# Altium project DCAC.PrjPcb (part 2 of 11)
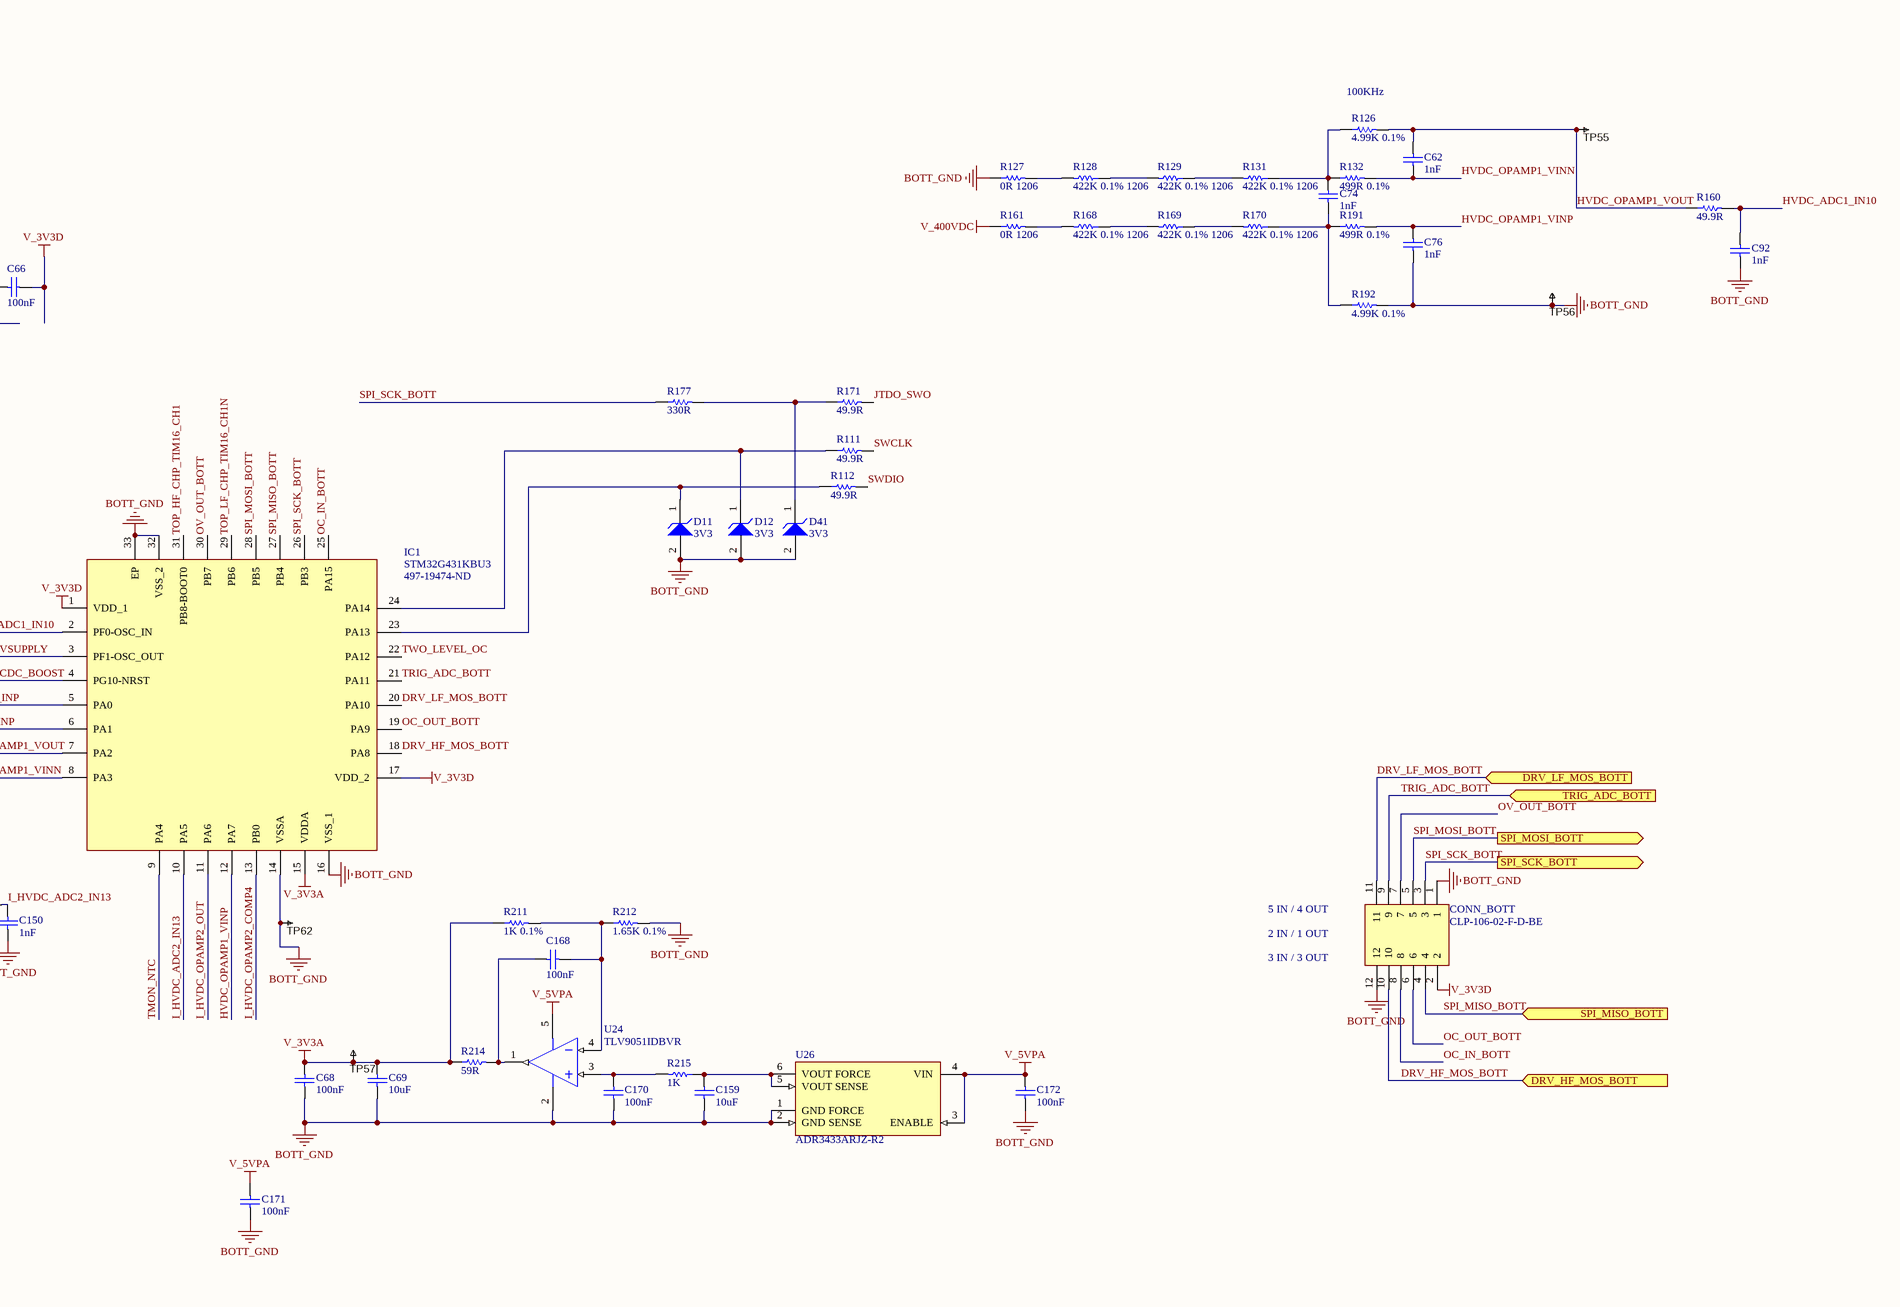
[diagram p12: Control_Sense_BOTT.SchDoc, bottom right]

## Sheet Control_Sense_BOTT.SchDoc (continued)
### Library data of the parts
BR1 = CD-HD2006L: Bridge Rectifier; Manufacturer_Name: Bourns; Datasheet Link: https://componentsearchengine.com/Datasheets/1/CD-HD2006L.pdf; Height: 1.22mm; Manufacturer_Part_Number: CD-HD2006L; Mouser Part Number: 652-CD-HD2006L; Mouser Price/Stock: https://www.mouser.co.uk/ProductDetail/Bourns/CD-HD2006L?qs=zwwtnr6GuIxiiAFbFRVfeg%3D%3D; Arrow Part Number: CD-HD2006L; Arrow Price/Stock: https://www.arrow.com/en/products/cd-hd2006l/bourns
C8 C186 = CAP: X5R ±10% 10V 22uF 1206 Multilayer Ceramic Capacitors MLCC - SMD/SMT ROHS; Manufacturer: Kyocera AVX; Manufacturer Part Number: 12066C226KAT2A; Tolerance: Â±10%; Case-EIA: 1206; Rated Voltage: 6.3 V; Case-Metric: 3216; Voltage Rating: 6.3V; Dielectric: X7R; Dissipation Factor: 5%; Technology: SMT; Max Thickness: 1.9 mm; Value: 22uF; Supplier 1: Digi-Key; Supplier Part Number 1: 478-5997-1-ND; RoHS: Yes; Category: Ceramic Capacitors; Stock 1: 4915; Pricing 1: 1=0.81000, 10=0.57100, 100=0.37570, 500=0.27830, 1000=0.23656 (USD); Mount: Surface Mount; Case/Package: 1206; Number of Pins: 2; Case Code (Imperial): 1206; Case Code (Metric): 3216; Contact Plating: Tin,Matte; Min Operating Temperature: -55°C; Max Operating Temperature: 125°C; Capacitance: 22uF; Packaging: Tape and Reel; Package Quantity: 2500; Termination: SMD/SMT; Voltage Rating (DC): 6.3V; Voltage: 6.3V; Length: 3.2mm; Height: 1.78mm; Width: 1.6mm; Depth: 1.6mm; Thickness: 0.07inch; Radiation Hardening: No; REACH SVHC: No SVHC; Lead Free: Lead Free; ComponentLink1URL: https://datasheet.ciiva.com/11786/0900766b80dc2409-11786266.pdf?src-supplier=RSComponents; ComponentLink1Description: https://datasheet.ciiva.com/11786/0900766b80dc2409-11786266.pdf?src-supplier=RSComponents; ComponentLink2URL: https://datasheet.ciiva.com/16315/cx7r-16315655.pdf?src-supplier=Future+Electronics; ComponentLink2Description: https://datasheet.ciiva.com/16315/cx7r-16315655.pdf?src-supplier=Future+Electronics; ComponentLink3URL: https://datasheet.ciiva.com/154/cx7r-154924.pdf?src-supplier=Digi-Key; ComponentLink3Description: https://datasheet.ciiva.com/154/cx7r-154924.pdf?src-supplier=Digi-Key; ComponentLink4URL: https://datasheet.ciiva.com/154/cx7r-154925.pdf?src-supplier=Digi-Key; ComponentLink4Description: https://datasheet.ciiva.com/154/cx7r-154925.pdf?src-supplier=Digi-Key; ComponentLink5URL: https://datasheet.ciiva.com/154/cx7r-154926.pdf?src-supplier=Digi-Key; ComponentLink5Description: https://datasheet.ciiva.com/154/cx7r-154926.pdf?src-supplier=Digi-Key; Parameter 1: *; JLCPCB Part #: C5672
C13 C177 = CAP-NP-2: X5R ±10% 50V 1uF 0603 Multilayer Ceramic Capacitors MLCC - SMD/SMT ROHS; Manufacturer: AVX; Rated Voltage: 10V; Capacitance: 1µF; Datasheet Version: 10/2007; Mounting Technology: SurfaceMount; Datasheet URL: https://datasheet.ciiva.com/11787/0900766b80a45521-11787469.pdf; Tolerance (%): ±10%; Package Description: 2-Pin Surface Mount Device, Body 1.6 x 0.81 mm; Case Size/Dimension: 0603; Package Reference: 0603; Manufacturer URL: http://www.avx.com/; Dielectric: X5R; Parameter 1: *; JLCPCB Part #: C15849
C23 C56 C57 C120 C121 C185 = CMP-2006-02595-1: C0G ±5% 50V 100pF 0603 Multilayer Ceramic Capacitors MLCC - SMD/SMT ROHS; Part Number: GRM1885C1H101JA01D; Manufacturer: Murata; Temperature Coefficient: 30ppm/°C; Insulation Resistance: 10GR; Supplier 1: Digi-Key; Supplier Part Number 1: 490-1427-1-ND; Manufacturer Part Number: GRM1885C1H101JA01D; RoHS: Yes; Category: Ceramic Capacitors; Pricing 1: 1=0.10000, 10=0.06100, 50=0.03320, 100=0.02700, 500=0.01932, 1000=0.01518 (USD); Mount: Surface Mount; Case/Package: 0603; Number of Pins: 2; Case Code (Metric): 1608; Case Code (Imperial): 0603; Dielectric Material: Ceramic; Material: Ceramic; Weight: 7.1E-05oz; Min Operating Temperature: -55°C; Max Operating Temperature: 125°C; Capacitance: 100pF; Voltage Rating: 50V; Tolerance: 5%; Packaging: Tape and Reel; Package Quantity: 1; Voltage Rating (DC): 50V; Dielectric: C0G; Termination: SMD/SMT; Voltage: 50V; Length: 1.6mm; Width: 0.031inch; Height: 0.8mm; Thickness: 0.035inch; Depth: 0.8mm; Radiation Hardening: No; REACH SVHC: Unknown; RoHS Compliant: Yes; Lead Free: Lead Free; ComponentLink1URL: https://datasheet.ciiva.com/131/product-131088.pdf?src-supplier=Digi-Key; ComponentLink1Description: https://datasheet.ciiva.com/131/product-131088.pdf?src-supplier=Digi-Key; ComponentLink2URL: https://datasheet.ciiva.com/18100/getdatasheetpartid-26823-18100641.pdf?src-supplier=Verical; ComponentLink2Description: https://datasheet.ciiva.com/18100/getdatasheetpartid-26823-18100641.pdf?src-supplier=Verical; ComponentLink3URL: https://datasheet.ciiva.com/3777/grm1885c1h101ja0123-3777264.pdf?src-supplier=Arrow+Electronics; ComponentLink3Description: https://datasheet.ciiva.com/3777/grm1885c1h101ja0123-3777264.pdf?src-supplier=Arrow+Electronics; ComponentLink4URL: https://datasheet.ciiva.com/29149/450134-da-01-en-vs-kondensator-0603-29149008.pdf?src-supplier=Conrad; ComponentLink4Description: https://datasheet.ciiva.com/29149/450134-da-01-en-vs-kondensator-0603-29149008.pdf?src-supplier=Conrad; ComponentLink5URL: https://datasheet.ciiva.com/131/partnumbering-e-01-131089.pdf?src-supplier=Digi-Key; ComponentLink5Description: https://datasheet.ciiva.com/131/partnumbering-e-01-131089.pdf?src-supplier=Digi-Key; ComponentLink6URL: https://datasheet.ciiva.com/11605/c02e-11605557.pdf?src-supplier=Avnet; ComponentLink6Description: https://datasheet.ciiva.com/11605/c02e-11605557.pdf?src-supplier=Avnet; ComponentLink7URL: https://datasheet.ciiva.com/28556/4360-28556551.pdf?src-supplier=Element14; ComponentLink7Description: https://datasheet.ciiva.com/28556/4360-28556551.pdf?src-supplier=Element14; ComponentLink8URL: https://datasheet.ciiva.com/7828/4360-7828889.pdf?src-supplier=Element14; ComponentLink8Description: https://datasheet.ciiva.com/7828/4360-7828889.pdf?src-supplier=Element14; ComponentLink9URL: https://datasheet.ciiva.com/7828/4360-7828890.pdf?src-supplier=Element14; ComponentLink9Description: https://datasheet.ciiva.com/7828/4360-7828890.pdf?src-supplier=Element14; ComponentLink10URL: https://datasheet.ciiva.com/7828/4360-7828891.pdf?src-supplier=Element14; ComponentLink10Description: https://datasheet.ciiva.com/7828/4360-7828891.pdf?src-supplier=Element14; ComponentLink11URL: https://datasheet.ciiva.com/14116/grmseries-tc-hitype-eng-14116828.pdf?src-supplier=Distrelec; ComponentLink11Description: https://datasheet.ciiva.com/14116/grmseries-tc-hitype-eng-14116828.pdf?src-supplier=Distrelec; ComponentLink12URL: https://datasheet.ciiva.com/16291/product-16291613.pdf?src-supplier=Future+Electronics; ComponentLink12Description: https://datasheet.ciiva.com/16291/product-16291613.pdf?src-supplier=Future+Electronics; ComponentLink13URL: https://datasheet.ciiva.com/131/partnumbering-e-01-131087.pdf?src-supplier=Digi-Key; ComponentLink13Description: https://datasheet.ciiva.com/131/partnumbering-e-01-131087.pdf?src-supplier=Digi-Key; ComponentLink14URL: https://datasheet.ciiva.com/14116/grmseries-tc-hitype-eng-14116815.pdf?src-supplier=Distrelec; ComponentLink14Description: https://datasheet.ciiva.com/14116/grmseries-tc-hitype-eng-14116815.pdf?src-supplier=Distrelec; JLCPCB Part #: C14858
  C23: Stock 1: 416176
  C56 C57 C120 C121 C185: Stock 1: 98306
C25-C28 C42 C43 C45 C47 C49 = CAP-NP-2: X5R ±10% 50V 10uF 1206 Multilayer Ceramic Capacitors MLCC - SMD/SMT ROHS; Manufacturer: AVX; Rated Voltage: 25V; Capacitance: 10µF; Mounting Technology: SurfaceMount; Package Reference: 1206; Tolerance (%): ±10%; Manufacturer URL: http://www.avx.com/; Datasheet URL: http://datasheets.avx.com/cx5r.pdf; Package Description: 2-Pin Surface Mount Device, Body 3.2 x 1.6 mm; Dielectric: X5R; Datasheet Version: 05/2016; Case Size/Dimension: 1206; JLCPCB Part #: C13585
C48 C53 C69 C90 C91 C100 C127 C173 = CAP: X5R 25V ±10% 10uF 0805 Multilayer Ceramic Capacitors MLCC - SMD/SMT ROHS; Part Number: GRM21BR71A106KE51L; Manufacturer: Murata; Parameter 1: *; JLCPCB Part #: C15850
C54 C55 C58 C66 C67 C71 C95 C98 C107 C109 C112 C123 C126 C136-C138 C161 C168 C170-C172 C176 C182 = CAP: X7R 100nF ±10% 50V 0603 Multilayer Ceramic Capacitors MLCC - SMD/SMT ROHS; Part Number: GCM188R72A104KA64D; Manufacturer: Murata; Manufacturer Part Number: CC0603KRX7R9BB104; Voltage Rating: 100V; Supplier 1: Arrow Electronics; Supplier Part Number 1: GCM188R72A104KA64D; RoHS: Yes; Category: Ceramic Capacitors; Mount: Surface Mount; Case/Package: 0603; Case Code (Imperial): 0603; Case Code (Metric): 1608; Min Operating Temperature: -55°C; Max Operating Temperature: 125°C; Tolerance: 10%; Packaging: Tape and Reel; Capacitance: 100nF; Dielectric: X7R; Termination: SMD/SMT; Voltage Rating (DC): 100V; Length: 1.6mm; Height: 0.8mm; Depth: 0.8mm; Radiation Hardening: No; ComponentLink1URL: https://datasheet.ciiva.com/17451/product-17451047.pdf?src-supplier=Avnet+Europe; ComponentLink1Description: https://datasheet.ciiva.com/17451/product-17451047.pdf?src-supplier=Avnet+Europe; ComponentLink2URL: https://datasheet.ciiva.com/26889/getdatasheetpartid-387765-26889164.pdf?src-supplier=Verical; ComponentLink2Description: https://datasheet.ciiva.com/26889/getdatasheetpartid-387765-26889164.pdf?src-supplier=Verical; Parameter 1: *; JLCPCB Part #: C14663
C62 C74 C76 = CMP-2006-04245-1: X7R 1nF ±10% 50V 0603 Multilayer Ceramic Capacitors MLCC - SMD/SMT ROHS; Manufacturer: AVX Interconnect / Elco; Part Number: 06035A151JAT2A.; Manufacturer Part Number: 06035A151JAT2A; Capacitance: 100pF; Tolerance: 5%; Dielectric: C0G; Temperature Coefficient: 30ppm/°C; Insulation Resistance: 100GR; Supplier 1: Digi-Key; Supplier Part Number 1: 478-1177-1-ND; RoHS: Yes; Category: Ceramic Capacitors; Stock 1: 63714; Pricing 1: 1=0.12000, 10=0.08900, 100=0.04180, 500=0.02932, 1000=0.02428 (USD); Mount: Surface Mount,PCB; Case/Package: 0603; Number of Pins: 2; Case Code (Metric): 1608; Case Code (Imperial): 0603; Dielectric Material: Ceramic; Contact Plating: Tin,Matte; Min Operating Temperature: -55°C; Max Operating Temperature: 125°C; Voltage Rating (DC): 50V; Voltage Rating: 50V; Packaging: Tape and Reel; Package Quantity: 1; Termination: SMD/SMT; Voltage: 50V; Length: 1.6mm; Height: 0.86mm; Width: 0.032inch; Depth: 0.81mm; Thickness: 0.035inch; Radiation Hardening: No; Lead Free: Lead Free; REACH SVHC: No SVHC; ComponentLink1URL: https://datasheet.ciiva.com/1124/84496-1124721.pdf?src-supplier=Element14; ComponentLink1Description: https://datasheet.ciiva.com/1124/84496-1124721.pdf?src-supplier=Element14; ComponentLink2URL: https://datasheet.ciiva.com/2987/ccog-2987781.pdf?src-supplier=Avnet; ComponentLink2Description: https://datasheet.ciiva.com/2987/ccog-2987781.pdf?src-supplier=Avnet; ComponentLink3URL: https://datasheet.ciiva.com/7855/759117-7855061.pdf?src-supplier=Element14; ComponentLink3Description: https://datasheet.ciiva.com/7855/759117-7855061.pdf?src-supplier=Element14; ComponentLink4URL: https://datasheet.ciiva.com/2987/ccog-2987782.pdf?src-supplier=Avnet; ComponentLink4Description: https://datasheet.ciiva.com/2987/ccog-2987782.pdf?src-supplier=Avnet; ComponentLink5URL: https://datasheet.ciiva.com/156/ccog-156216.pdf?src-supplier=Digi-Key; ComponentLink5Description: https://datasheet.ciiva.com/156/ccog-156216.pdf?src-supplier=Digi-Key; ComponentLink6URL: https://datasheet.ciiva.com/156/ccog-156217.pdf?src-supplier=Digi-Key; ComponentLink6Description: https://datasheet.ciiva.com/156/ccog-156217.pdf?src-supplier=Digi-Key; ComponentLink7URL: https://datasheet.ciiva.com/156/ccog-156218.pdf?src-supplier=Digi-Key; ComponentLink7Description: https://datasheet.ciiva.com/156/ccog-156218.pdf?src-supplier=Digi-Key; ComponentLink8URL: https://datasheet.ciiva.com/16300/ccog-16300429.pdf?src-supplier=Future+Electronics; ComponentLink8Description: https://datasheet.ciiva.com/16300/ccog-16300429.pdf?src-supplier=Future+Electronics; ComponentLink9URL: https://datasheet.ciiva.com/22699/84496-22699966.pdf?src-supplier=Element14; ComponentLink9Description: https://datasheet.ciiva.com/22699/84496-22699966.pdf?src-supplier=Element14; ComponentLink10URL: https://datasheet.ciiva.com/5418/ccog-5418335.pdf?src-supplier=Mouser; ComponentLink10Description: https://datasheet.ciiva.com/5418/ccog-5418335.pdf?src-supplier=Mouser; ComponentLink11URL: https://datasheet.ciiva.com/16538/ccog-16538111.pdf?src-supplier=Avnet+Asia; ComponentLink11Description: https://datasheet.ciiva.com/16538/ccog-16538111.pdf?src-supplier=Avnet+Asia; Parameter 2: *; JLCPCB Part #: C1588
C68 C72 C104 C114 = CAP: X7R 100nF ±10% 16V 0402 Multilayer Ceramic Capacitors MLCC - SMD/SMT ROHS; Manufacturer: AVX Interconnect / Elco; Part Number: 04026D104KAT2A; Voltage Rating: 6.3V; Dielectric: X5R; Supplier 1: Newark; Supplier Part Number 1: 34M9214; Manufacturer Part Number: 04026D104KAT2A; RoHS: Yes; Category: Ceramic Capacitors; Stock 1: 1436; Pricing 1: 10=0.02800, 25=0.02300, 50=0.01800, 100=0.01200, 250=0.01100, 500=0.00900, 1000=0.00700 (USD); Mount: Surface Mount; Case/Package: 0402; Case Code (Metric): 1005; Case Code (Imperial): 0402; Contact Plating: Tin,Matte; Dielectric Material: Ceramic; Min Operating Temperature: -55°C; Max Operating Temperature: 85°C; Package Quantity: 1; Packaging: Tape and Reel; Capacitance: 100nF; Tolerance: 10%; Voltage Rating (DC): 6.3V; Voltage: 6.3V; Termination: SMD/SMT; Series: -; Construction: Flat; Length: 1mm; Width: 0.02inch; Height: 0.56mm; Thickness: 0.022inch; Depth: 0.5mm; Radiation Hardening: No; REACH SVHC: No SVHC; Lead Free: Lead Free; RoHS Compliant: Yes; Parameter 1: *; JLCPCB Part #: C1525
C77 = CAP-NP-2: X7R ±10% 50V 4.7uF 1206 Multilayer Ceramic Capacitors MLCC - SMD/SMT ROHS; Manufacturer: Kemet; Temperature Coefficient / Code: +/-15%; Voltage Rating DC: 25V; Capacitance - nF: 1000nF; Class: Class1; Case Length: 3.2mm; Type: SMDMLCCX7R6.3-250VDCCommericalGrade; Case Width: 1.6mm; Product: GeneralTypeMLCCs; Dielectric: X7R; Datasheet URL: https://ciiva.com/datasheet-click-18194173?src=ciiva&sig=6daff8c4; Operating Temperature Range: -55Cto+125C; Series: C1206C; RoHS: Details; Product Category: MultilayerCeramicCapacitorsMLCC-SMD/SMT; Manufacturer URL: http://www.kemet.com/; Minimum Operating Temperature: -55C; Dimensions: 1.6mmWx3.2mmLx1.6mmH; Termination Style: SMD/SMT; Brand: Kemet; Packaging: Reel; Package / Case: 1206(3216metric); Case Code - mm: 3216; Datasheet Version: Jul-14; Factory Pack Quantity: 2000; Package Description: 2-Pin Surface Mount Device, Body 3.2 x 1.6 mm; Tolerance: 10%; Package Reference: 1206; Case Height: 1.6mm; Case Code - in: 1206; Maximum Operating Temperature: +125C; Voltage Rating: 25V; Parameter 1: *; JLCPCB Part #: C29823
C92 C144 C150 = CMP-2008-02701-1: X7R 1nF ±10% 50V 0402 Multilayer Ceramic Capacitors MLCC - SMD/SMT ROHS; Manufacturer: AVX Interconnect / Elco; Part Number: 04025C102MAT2A; Tolerance: 20%; Supplier 1: Digi-Key; Supplier Part Number 1: 478-5130-1-ND; Manufacturer Part Number: 04025C102MAT2A; RoHS: Yes; Category: Ceramic Capacitors; Stock 1: 32316; Pricing 1: 1=0.10000, 10=0.03300, 50=0.01800, 100=0.01470, 500=0.01046, 1000=0.00822, 2500=0.00748, 5000=0.00688 (USD); Mount: Surface Mount; Case/Package: 0402; Case Code (Metric): 1005; Case Code (Imperial): 0402; Min Operating Temperature: -55°C; Max Operating Temperature: 125°C; Capacitance: 1nF; Voltage Rating: 50V; Packaging: Tape and Reel; Package Quantity: 1; Voltage Rating (DC): 50V; Dielectric: X7R; Voltage: 50V; Series: -; Termination: SMD/SMT; Construction: Flat; Length: 1mm; Width: 0.02inch; Height: 0.56mm; Thickness: 0.022inch; Depth: 0.5mm; Radiation Hardening: No; RoHS Compliant: Yes; Lead Free: Lead Free; REACH SVHC: No SVHC; ComponentLink1URL: https://datasheet.ciiva.com/11787/0900766b80dc2409-11787048.pdf?src-supplier=RSComponents; ComponentLink1Description: https://datasheet.ciiva.com/11787/0900766b80dc2409-11787048.pdf?src-supplier=RSComponents; ComponentLink2URL: https://datasheet.ciiva.com/150/cx7r-150278.pdf?src-supplier=Digi-Key; ComponentLink2Description: https://datasheet.ciiva.com/150/cx7r-150278.pdf?src-supplier=Digi-Key; ComponentLink3URL: https://datasheet.ciiva.com/5424/cx7r-218113-5424822.pdf?src-supplier=Mouser; ComponentLink3Description: https://datasheet.ciiva.com/5424/cx7r-218113-5424822.pdf?src-supplier=Mouser; ComponentLink4URL: https://datasheet.ciiva.com/150/cx7r-150279.pdf?src-supplier=Digi-Key; ComponentLink4Description: https://datasheet.ciiva.com/150/cx7r-150279.pdf?src-supplier=Digi-Key; ComponentLink5URL: https://datasheet.ciiva.com/150/cx7r-150280.pdf?src-supplier=Digi-Key; ComponentLink5Description: https://datasheet.ciiva.com/150/cx7r-150280.pdf?src-supplier=Digi-Key; ComponentLink6URL: https://datasheet.ciiva.com/16327/cx7r-16327672.pdf?src-supplier=Future+Electronics; ComponentLink6Description: https://datasheet.ciiva.com/16327/cx7r-16327672.pdf?src-supplier=Future+Electronics; ComponentLink7URL: https://datasheet.ciiva.com/1123/1679506-1123707.pdf?src-supplier=Element14; ComponentLink7Description: https://datasheet.ciiva.com/1123/1679506-1123707.pdf?src-supplier=Element14; ComponentLink8URL: https://datasheet.ciiva.com/1123/1679506-1123708.pdf?src-supplier=Element14; ComponentLink8Description: https://datasheet.ciiva.com/1123/1679506-1123708.pdf?src-supplier=Element14; ComponentLink9URL: https://datasheet.ciiva.com/11510/cx7r-11510958.pdf?src-supplier=Avnet; ComponentLink9Description: https://datasheet.ciiva.com/11510/cx7r-11510958.pdf?src-supplier=Avnet; ComponentLink10URL: https://datasheet.ciiva.com/16623/cx7r-16623374.pdf?src-supplier=Avnet+Europe; ComponentLink10Description: https://datasheet.ciiva.com/16623/cx7r-16623374.pdf?src-supplier=Avnet+Europe; JLCPCB Part #: C1523
C105 C113 C117 = CMP-2100-03644-1: X7R ±10% 50V 330nF 0805 Multilayer Ceramic Capacitors MLCC - SMD/SMT ROHS; Manufacturer: Murata; Manufacturer Part Number: GRM21BR71H104KA01L; Capacitance: 100nF; Insulation Resistance: 10GR; Package Description: 2-Pin Surface Mount Device, Body 2 x 1.25 mm; Manufacturer URL: http://www.murata.com/; Case Code (Imperial): 0805; Voltage: 50V; Datasheet URL: http://psearch.en.murata.com/capacitor/product/GRM21BR71H104KA01%23.pdf; Termination: SMD/SMT; Lead Free: LeadFree; Package Quantity: 1; Mount: SurfaceMount; REACH SVHC: Unknown; Thickness: 0.053inch; Height: 1.25mm; Case/Package: 0805; Voltage Rating: 50V; Dielectric Material: Ceramic; Width: 0.049inch; Case Code (Metric): 2012; Material: Ceramic; Min Operating Temperature: -55degC; RoHSCompliant: true; Datasheet Version: 42675.0; Voltage Rating (DC): 50V; Tolerance: 10%; Dielectric: X7R; Package Reference: 0805; Depth: 1.25mm; Length: 2mm; Max Operating Temperature: 125degC; Packaging: TapeandReel; Number of Pins: 2; Radiation Hardening: No; Supplier 1: Farnell; Supplier Part Number 1: 2408531; RoHS: Yes; Category: Ceramic Capacitors; Stock 1: 576000; ComponentLink1URL: https://datasheet.ciiva.com/11786/0900766b8003061f-11786305.pdf?src-supplier=RSComponents; ComponentLink1Description: https://datasheet.ciiva.com/11786/0900766b8003061f-11786305.pdf?src-supplier=RSComponents; ComponentLink2URL: https://datasheet.ciiva.com/20173/71-2024-20173169.pdf?src-supplier=Rapid+Electronics; ComponentLink2Description: https://datasheet.ciiva.com/20173/71-2024-20173169.pdf?src-supplier=Rapid+Electronics; ComponentLink3URL: https://datasheet.ciiva.com/29200/453120-da-01-en-vs-kondensator-0805-29200537.pdf?src-supplier=Conrad; ComponentLink3Description: https://datasheet.ciiva.com/29200/453120-da-01-en-vs-kondensator-0805-29200537.pdf?src-supplier=Conrad; ComponentLink4URL: https://datasheet.ciiva.com/132/partnumbering-e-01-132209.pdf?src-supplier=Digi-Key; ComponentLink4Description: https://datasheet.ciiva.com/132/partnumbering-e-01-132209.pdf?src-supplier=Digi-Key; ComponentLink5URL: https://datasheet.ciiva.com/132/partnumbering-e-01-132210.pdf?src-supplier=Digi-Key; ComponentLink5Description: https://datasheet.ciiva.com/132/partnumbering-e-01-132210.pdf?src-supplier=Digi-Key; ComponentLink6URL: https://datasheet.ciiva.com/132/partnumbering-e-01-132211.pdf?src-supplier=Digi-Key; ComponentLink6Description: https://datasheet.ciiva.com/132/partnumbering-e-01-132211.pdf?src-supplier=Digi-Key; ComponentLink7URL: https://datasheet.ciiva.com/7937/1794405-7937708.pdf?src-supplier=Element14; ComponentLink7Description: https://datasheet.ciiva.com/7937/1794405-7937708.pdf?src-supplier=Element14; ComponentLink8URL: https://datasheet.ciiva.com/7937/1794405-7937709.pdf?src-supplier=Element14; ComponentLink8Description: https://datasheet.ciiva.com/7937/1794405-7937709.pdf?src-supplier=Element14; ComponentLink9URL: https://datasheet.ciiva.com/28534/1769893-28534317.pdf?src-supplier=Element14; ComponentLink9Description: https://datasheet.ciiva.com/28534/1769893-28534317.pdf?src-supplier=Element14; ComponentLink10URL: https://datasheet.ciiva.com/7937/4360-7937710.pdf?src-supplier=Element14; ComponentLink10Description: https://datasheet.ciiva.com/7937/4360-7937710.pdf?src-supplier=Element14; JLCPCB Part #: C1740
C106 C110 C159 = CAP-NP-2: X5R ±10% 10V 10uF 0603 Multilayer Ceramic Capacitors MLCC - SMD/SMT ROHS; Manufacturer: Samsung Electro-Mechanics; Manufacturer Part Number: CL10B104KB8NNNC; Capacitance: 0.1µF; Rated Voltage: 50V; Dielectric: X7R; Case Size/Dimension: 0603; Datasheet URL: https://datasheet.ciiva.com/29198/456651-da-01-en-vs-kondensator-0605-29198839.pdf; Manufacturer URL: http://www.samsungsem.com/global/index.jsp; Tolerance (%): ±10%; Datasheet Version: Nov-10; Supplier 1: Digi-Key; Supplier Part Number 1: 1276-1000-1-ND; RoHS: Yes; Category: Ceramic Capacitors; Stock 1: 13409690; Pricing 1: 1=0.10000, 10=0.03000, 50=0.01620, 100=0.01330, 500=0.00950, 1000=0.00746 (USD); Mount: Surface Mount; Case/Package: 0603; Case Code (Metric): 1608; Case Code (Imperial): 0603; Contact Plating: Tin; Material: Ceramic; Min Operating Temperature: -55°C; Max Operating Temperature: 125°C; Voltage Rating: 50V; Package Quantity: 1; Packaging: Tape and Reel; Tolerance: 10%; Voltage Rating (DC): 50V; Voltage: 50V; Series: CL; Construction: Flat; Length: 1.6mm; Width: 0.031inch; Height: 0.8mm; Depth: 0.8mm; Thickness: 0.035inch; Radiation Hardening: No; Lead Free: Lead Free; RoHS Compliant: Yes; ComponentLink1URL: https://datasheet.ciiva.com/25803/cl10b104kb8nnnc-25803393.pdf?src-supplier=Digi-Key; ComponentLink1Description: https://datasheet.ciiva.com/25803/cl10b104kb8nnnc-25803393.pdf?src-supplier=Digi-Key; ComponentLink2URL: https://datasheet.ciiva.com/26838/getdatasheetpartid-89097-26838411.pdf?src-supplier=Verical; ComponentLink2Description: https://datasheet.ciiva.com/26838/getdatasheetpartid-89097-26838411.pdf?src-supplier=Verical; ComponentLink3URL: https://datasheet.ciiva.com/29198/456651-da-01-en-vs-kondensator-0605-29198839.pdf?src-supplier=Conrad; ComponentLink3Description: https://datasheet.ciiva.com/29198/456651-da-01-en-vs-kondensator-0605-29198839.pdf?src-supplier=Conrad; Parameter 1: *; JLCPCB Part #: C19702
C118 C119 = CMP-2008-04245-1: C0G ±5% 50V 100pF 0402 Multilayer Ceramic Capacitors MLCC - SMD/SMT ROHS; Part Number: GRM1555C1H100JA01D; Manufacturer: Murata; Capacitance: 10pF; Temperature Coefficient: 30ppm/°C; Supplier 1: Digi-Key; Supplier Part Number 1: 490-5921-1-ND; Manufacturer Part Number: GRM1555C1H100JA01D; RoHS: Yes; Category: Ceramic Capacitors; Stock 1: 1896512; Pricing 1: 1=0.10000, 10=0.01900, 50=0.01060, 100=0.00860, 500=0.00616, 1000=0.00484, 2500=0.00440, 5000=0.00405 (USD); Mount: Surface Mount; Case/Package: 0402; Number of Pins: 2; Case Code (Metric): 1005; Case Code (Imperial): 0402; Material: Ceramic; Min Operating Temperature: -55°C; Max Operating Temperature: 125°C; Tolerance: 5%; Dielectric: C0G; Voltage Rating: 50V; Packaging: Tape and Reel; Package Quantity: 10000; Voltage Rating (DC): 50V; Termination: SMD/SMT; Series: GRM; Construction: Flat; Voltage: 50V; Length: 1mm; Width: 0.02inch; Height: 0.5mm; Thickness: 0.022inch; Depth: 0.5mm; Radiation Hardening: No; RoHS Compliant: Yes; REACH SVHC: No SVHC; Lead Free: Lead Free; ComponentLink1URL: https://datasheet.ciiva.com/2989/product-2989280.pdf?src-supplier=Avnet; ComponentLink1Description: https://datasheet.ciiva.com/2989/product-2989280.pdf?src-supplier=Avnet; ComponentLink2URL: https://datasheet.ciiva.com/18184/getdatasheetpartid-307234-18184164.pdf?src-supplier=Verical; ComponentLink2Description: https://datasheet.ciiva.com/18184/getdatasheetpartid-307234-18184164.pdf?src-supplier=Verical; ComponentLink3URL: https://datasheet.ciiva.com/29200/453545-da-01-en-vs-kondensator-0402-29200107.pdf?src-supplier=Conrad; ComponentLink3Description: https://datasheet.ciiva.com/29200/453545-da-01-en-vs-kondensator-0402-29200107.pdf?src-supplier=Conrad; ComponentLink4URL: https://datasheet.ciiva.com/6271/partnumbering-e-01-6271158.pdf?src-supplier=Digi-Key; ComponentLink4Description: https://datasheet.ciiva.com/6271/partnumbering-e-01-6271158.pdf?src-supplier=Digi-Key; ComponentLink5URL: https://datasheet.ciiva.com/48671/product-48671350.pdf?src-supplier=Avnet; ComponentLink5Description: https://datasheet.ciiva.com/48671/product-48671350.pdf?src-supplier=Avnet; ComponentLink6URL: https://datasheet.ciiva.com/6271/partnumbering-e-01-6271159.pdf?src-supplier=Digi-Key; ComponentLink6Description: https://datasheet.ciiva.com/6271/partnumbering-e-01-6271159.pdf?src-supplier=Digi-Key; ComponentLink7URL: https://datasheet.ciiva.com/6271/partnumbering-e-01-6271068.pdf?src-supplier=Digi-Key; ComponentLink7Description: https://datasheet.ciiva.com/6271/partnumbering-e-01-6271068.pdf?src-supplier=Digi-Key; ComponentLink8URL: https://datasheet.ciiva.com/7828/1666664-7828812.pdf?src-supplier=Element14; ComponentLink8Description: https://datasheet.ciiva.com/7828/1666664-7828812.pdf?src-supplier=Element14; JLCPCB Part #: C1546
C124 C125 = CAPC_1u_0805_X7R_16V_10%: X5R 25V ±10% 4.7uF 0805 Multilayer Ceramic Capacitors MLCC - SMD/SMT ROHS; Manufacturer 1: Yageo; Manufacturer Part Number 1: CC0805KKX7R7BB105; Ratings: 16V; X7R; SCDType: spec; Temperature Coefficient: X7R; Package / Case: 0805 (2012 metric); Tolerance: ±10%; Material: ceramic; Supplier 1: Digi-Key; Supplier Part Number 1: 311-1365-6-ND; RoHS 1: RoHS Compliant; ComponentLink1URL: http://www.yageo.com/documents/recent/UPY-GPHC_X7R_6.3V-to-50V_8.pdf; ComponentLink1Description: http://www.yageo.com/documents/recent/UPY-GPHC_X7R_6.3V-to-50V_8.pdf; Supplier 2: Digi-Key; Supplier Part Number 2: 399-1284-6-ND; Manufacturer 2: Kemet; Manufacturer Part Number 2: C0805C105K4RACTU; RoHS 2: RoHS Compliant; ComponentLink2URL: http://www.kemet.com/datasheets&C0805C105K4RACTU; ComponentLink2Description: http://www.kemet.com/datasheets&C0805C105K4RACTU; Supplier 3: Digi-Key; Supplier Part Number 3: 1276-1026-6-ND; Manufacturer 3: Samsung Electro-Mechanics America, Inc; Manufacturer Part Number 3: CL21B105KOFNNNE; RoHS 3: RoHS Compliant; ComponentLink3URL: http://www.samsungsem.com/servlet/FileDownload?type=spec&file=CL21B105KOFNNNE.pdf; ComponentLink3Description: http://www.samsungsem.com/servlet/FileDownload?type=spec&file=CL21B105KOFNNNE.pdf; Supplier 4: Digi-Key; Supplier Part Number 4: 445-1358-6-ND; Manufacturer 4: TDK Corporation; Manufacturer Part Number 4: C2012X7R1C105K125AA; RoHS 4: RoHS Compliant; ComponentLink4URL: http://product.tdk.com/capacitor/mlcc/en/documents/mlcc_commercial_general_en.pdf; ComponentLink4Description: http://product.tdk.com/capacitor/mlcc/en/documents/mlcc_commercial_general_en.pdf; JLCPCB Part #: C1779
C129 = CMP-2006-02924-1: X7R ±10% 50V 10nF 0603 Multilayer Ceramic Capacitors MLCC - SMD/SMT ROHS; Part Number: GRM188R71H472KA01D; Manufacturer: Murata; Capacitance: 4.7nF; Insulation Resistance: 10GR; Supplier 1: Farnell; Supplier Part Number 1: 1118177; Manufacturer Part Number: GRM188R71H472KA01D; RoHS: Yes; Category: Ceramic Capacitors; Pricing 1: 1=19.92000, 3=19.13000 (GBP); Mount: Surface Mount; Case/Package: 0603; Number of Pins: 2; Case Code (Imperial): 0603; Case Code (Metric): 1608; Dielectric Material: Ceramic; Material: Ceramic; Min Operating Temperature: -55°C; Max Operating Temperature: 125°C; Voltage Rating (DC): 50V; Tolerance: 10%; Packaging: Tape and Reel; Dielectric: X7R; Series: GRM; Voltage Rating: 50V; Package Quantity: 1; Termination: SMD/SMT; Voltage: 50V; Length: 1.6mm; Width: 0.8mm; Height: 0.8mm; Depth: 0.8mm; Thickness: 0.035inch; Radiation Hardening: No; RoHS Compliant: Yes; REACH SVHC: No SVHC; Lead Free: Lead Free; ComponentLink1URL: https://datasheet.ciiva.com/5412/product-5412608.pdf?src-supplier=Mouser; ComponentLink1Description: https://datasheet.ciiva.com/5412/product-5412608.pdf?src-supplier=Mouser; ComponentLink2URL: https://datasheet.ciiva.com/18102/getdatasheetpartid-75298-18102657.pdf?src-supplier=Verical; ComponentLink2Description: https://datasheet.ciiva.com/18102/getdatasheetpartid-75298-18102657.pdf?src-supplier=Verical; ComponentLink3URL: https://datasheet.ciiva.com/11787/0900766b8003061f-11787116.pdf?src-supplier=RSComponents; ComponentLink3Description: https://datasheet.ciiva.com/11787/0900766b8003061f-11787116.pdf?src-supplier=RSComponents; ComponentLink4URL: https://datasheet.ciiva.com/29201/451888-da-01-en-vs-kondensator-0603-29201828.pdf?src-supplier=Conrad; ComponentLink4Description: https://datasheet.ciiva.com/29201/451888-da-01-en-vs-kondensator-0603-29201828.pdf?src-supplier=Conrad; ComponentLink5URL: https://datasheet.ciiva.com/7937/4360-7937669.pdf?src-supplier=Element14; ComponentLink5Description: https://datasheet.ciiva.com/7937/4360-7937669.pdf?src-supplier=Element14; ComponentLink6URL: https://datasheet.ciiva.com/48428/nmgrm-data-en-48428597.pdf?src-supplier=Distrelec; ComponentLink6Description: https://datasheet.ciiva.com/48428/nmgrm-data-en-48428597.pdf?src-supplier=Distrelec; ComponentLink7URL: https://datasheet.ciiva.com/7937/4360-7937670.pdf?src-supplier=Element14; ComponentLink7Description: https://datasheet.ciiva.com/7937/4360-7937670.pdf?src-supplier=Element14; ComponentLink8URL: https://datasheet.ciiva.com/7937/4360-7937671.pdf?src-supplier=Element14; ComponentLink8Description: https://datasheet.ciiva.com/7937/4360-7937671.pdf?src-supplier=Element14; ComponentLink9URL: https://datasheet.ciiva.com/130/partnumbering-e-01-130733.pdf?src-supplier=Digi-Key; ComponentLink9Description: https://datasheet.ciiva.com/130/partnumbering-e-01-130733.pdf?src-supplier=Digi-Key; ComponentLink10URL: https://datasheet.ciiva.com/130/partnumbering-e-01-130734.pdf?src-supplier=Digi-Key; ComponentLink10Description: https://datasheet.ciiva.com/130/partnumbering-e-01-130734.pdf?src-supplier=Digi-Key; ComponentLink11URL: https://datasheet.ciiva.com/130/partnumbering-e-01-130735.pdf?src-supplier=Digi-Key; ComponentLink11Description: https://datasheet.ciiva.com/130/partnumbering-e-01-130735.pdf?src-supplier=Digi-Key; JLCPCB Part #: C57112
C178-C181 = CMP-2000-05478-1: Ceramic Capacitor, 25 V, 22 uF, +/-10%, -55 to 85 degC, 2-Pin SMD (1210), RoHS, Tape and Reel; Manufacturer Part Number: 12103D226KAT2A; Temperature Coefficient / Code: +/-15%; Case Height: 2.79mm; Brand: AVX; Case Width: 2.5mm; Tolerance: 10%; Voltage Rating: 25V; Dielectric: X5R; Case Length: 3.2mm; Type: StandardX5RMLCCs; Case Code - in: 1210; Packaging: Reel; Minimum Operating Temperature: -55C; Package Reference: 1210; Product Category: MultilayerCeramicCapacitorsMLCC-SMD/SMT; Package / Case: 1210(3225metric); Dimensions: 2.5mmWx3.2mmLx2.79mmH; Capacitance: 22uF; RoHS: Details; Manufacturer: AVX; Case Code - mm: 3225; Maximum Operating Temperature: +85C; Operating Temperature Range: -55Cto+85C; Mounting Technology: SurfaceMount; Product: GeneralTypeMLCCs; Manufacturer URL: http://www.avx.com/; Termination Style: SMD/SMT; Package Description: 2-Pin Surface Mount Device, Body 3.2 x 2.5 mm; Datasheet URL: http://datasheets.avx.com/cx5r.pdf; Datasheet Version: 05/2016; Voltage Rating DC: 25V; Factory Pack Quantity: 1000; Supplier 1: Newark; Supplier Part Number 1: 85R5759; Category: Ceramic Capacitors; Stock 1: 476; Pricing 1: 1=1.70000, 10=1.26000, 25=1.18000, 50=1.10000, 100=1.02000 (USD); Mount: Surface Mount; Case/Package: 1210; Number of Pins: 2; Case Code (Metric): 3225; Case Code (Imperial): 1210; Contact Plating: Tin,Matte; Min Operating Temperature: -55°C; Max Operating Temperature: 85°C; Package Quantity: 1000; Voltage Rating (DC): 25V; Termination: SMD/SMT; Series: Hi-Cap MLCC; Length: 3.2mm; Width: 0.098inch; Height: 2.79mm; Thickness: 0.11inch; Depth: 2.5mm; Radiation Hardening: No; REACH SVHC: No SVHC; Lead Free: Lead Free; RoHS Compliant: Yes; ComponentLink1URL: https://datasheet.ciiva.com/154/cx5r-154880.pdf?src-supplier=Digi-Key; ComponentLink1Description: https://datasheet.ciiva.com/154/cx5r-154880.pdf?src-supplier=Digi-Key; ComponentLink2URL: https://datasheet.ciiva.com/5423/cx5r-33896-5423477.pdf?src-supplier=Mouser; ComponentLink2Description: https://datasheet.ciiva.com/5423/cx5r-33896-5423477.pdf?src-supplier=Mouser; ComponentLink3URL: https://datasheet.ciiva.com/11500/cx5r-11500021.pdf?src-supplier=Avnet; ComponentLink3Description: https://datasheet.ciiva.com/11500/cx5r-11500021.pdf?src-supplier=Avnet; ComponentLink4URL: https://datasheet.ciiva.com/16625/cx5r-16625126.pdf?src-supplier=Avnet+Europe; ComponentLink4Description: https://datasheet.ciiva.com/16625/cx5r-16625126.pdf?src-supplier=Avnet+Europe; ComponentLink5URL: https://datasheet.ciiva.com/7709/1666675-7709623.pdf?src-supplier=Element14; ComponentLink5Description: https://datasheet.ciiva.com/7709/1666675-7709623.pdf?src-supplier=Element14; ComponentLink6URL: https://datasheet.ciiva.com/16426/cx5r-16426551.pdf?src-supplier=Future+Electronics; ComponentLink6Description: https://datasheet.ciiva.com/16426/cx5r-16426551.pdf?src-supplier=Future+Electronics; ComponentLink7URL: https://datasheet.ciiva.com/7709/1796776-7709624.pdf?src-supplier=Element14; ComponentLink7Description: https://datasheet.ciiva.com/7709/1796776-7709624.pdf?src-supplier=Element14; ComponentLink8URL: https://datasheet.ciiva.com/16537/cx5r-16537162.pdf?src-supplier=Avnet+Asia; ComponentLink8Description: https://datasheet.ciiva.com/16537/cx5r-16537162.pdf?src-supplier=Avnet+Asia; ComponentLink9URL: https://datasheet.ciiva.com/28592/759405-28592876.pdf?src-supplier=Element14; ComponentLink9Description: https://datasheet.ciiva.com/28592/759405-28592876.pdf?src-supplier=Element14; ComponentLink10URL: https://datasheet.ciiva.com/154/cx5r-154878.pdf?src-supplier=Digi-Key; ComponentLink10Description: https://datasheet.ciiva.com/154/cx5r-154878.pdf?src-supplier=Digi-Key; ComponentLink11URL: https://datasheet.ciiva.com/154/cx5r-154879.pdf?src-supplier=Digi-Key; ComponentLink11Description: https://datasheet.ciiva.com/154/cx5r-154879.pdf?src-supplier=Digi-Key; ComponentLink12URL: https://datasheet.ciiva.com/2988/cx5r-2988191.pdf?src-supplier=Avnet; ComponentLink12Description: https://datasheet.ciiva.com/2988/cx5r-2988191.pdf?src-supplier=Avnet
C183 C184 = CMP-2006-02927-1: X7R ±10% 50V 47nF 0603 Multilayer Ceramic Capacitors MLCC - SMD/SMT ROHS; Manufacturer: Murata; Part Number: GRM188R71H473KA61D; Insulation Resistance: 10GR; Supplier 1: Arrow Electronics; Supplier Part Number 1: GRM188R71H473KA61D; Manufacturer Part Number: GRM188R71H473KA61D; RoHS: Yes; Category: Ceramic Capacitors; Stock 1: 388000; Pricing 1: 4000=0.02460, 8000=0.02420, 12000=0.02400, 20000=0.02370, 24000=0.02350, 100000=0.02330 (USD); Mount: Surface Mount; Case/Package: 0603; Number of Pins: 2; Case Code (Metric): 1608; Case Code (Imperial): 0603; Dielectric Material: Ceramic; Material: Ceramic; Min Operating Temperature: -55°C; Max Operating Temperature: 125°C; Tolerance: 10%; Packaging: Tape and Reel; Capacitance: 47nF; Voltage Rating: 50V; Voltage Rating (DC): 50V; Dielectric: X7R; Voltage: 50V; Series: GRM; Package Quantity: 1; Termination: SMD/SMT; Construction: Flat; Length: 1.6mm; Width: 0.031inch; Height: 0.8mm; Depth: 0.8mm; Thickness: 0.035inch; Radiation Hardening: No; RoHS Compliant: Yes; REACH SVHC: No SVHC; Lead Free: Lead Free; ComponentLink1URL: https://datasheet.ciiva.com/132/grm188r71h473ka61-01-132379.pdf?src-supplier=Digi-Key; ComponentLink1Description: https://datasheet.ciiva.com/132/grm188r71h473ka61-01-132379.pdf?src-supplier=Digi-Key; ComponentLink2URL: https://datasheet.ciiva.com/132/grm188r71h473ka61-01-132380.pdf?src-supplier=Digi-Key; ComponentLink2Description: https://datasheet.ciiva.com/132/grm188r71h473ka61-01-132380.pdf?src-supplier=Digi-Key; ComponentLink3URL: https://datasheet.ciiva.com/11786/0900766b807a1cab-11786316.pdf?src-supplier=RSComponents; ComponentLink3Description: https://datasheet.ciiva.com/11786/0900766b807a1cab-11786316.pdf?src-supplier=RSComponents; ComponentLink4URL: https://datasheet.ciiva.com/132/grm188r71h473ka61-01-132381.pdf?src-supplier=Digi-Key; ComponentLink4Description: https://datasheet.ciiva.com/132/grm188r71h473ka61-01-132381.pdf?src-supplier=Digi-Key; ComponentLink5URL: https://datasheet.ciiva.com/18101/getdatasheetpartid-38124-18101149.pdf?src-supplier=Verical; ComponentLink5Description: https://datasheet.ciiva.com/18101/getdatasheetpartid-38124-18101149.pdf?src-supplier=Verical; ComponentLink6URL: https://datasheet.ciiva.com/29201/451904-da-01-en-vs-kondensator-0603-29201838.pdf?src-supplier=Conrad; ComponentLink6Description: https://datasheet.ciiva.com/29201/451904-da-01-en-vs-kondensator-0603-29201838.pdf?src-supplier=Conrad; ComponentLink7URL: https://datasheet.ciiva.com/7937/4360-7937672.pdf?src-supplier=Element14; ComponentLink7Description: https://datasheet.ciiva.com/7937/4360-7937672.pdf?src-supplier=Element14; ComponentLink8URL: https://datasheet.ciiva.com/14116/nmgrm-data-en-14116600.pdf?src-supplier=Distrelec; ComponentLink8Description: https://datasheet.ciiva.com/14116/nmgrm-data-en-14116600.pdf?src-supplier=Distrelec; ComponentLink9URL: https://datasheet.ciiva.com/7937/4360-7937673.pdf?src-supplier=Element14; ComponentLink9Description: https://datasheet.ciiva.com/7937/4360-7937673.pdf?src-supplier=Element14; ComponentLink10URL: https://datasheet.ciiva.com/48436/nmgrm-data-en-48436665.pdf?src-supplier=Distrelec; ComponentLink10Description: https://datasheet.ciiva.com/48436/nmgrm-data-en-48436665.pdf?src-supplier=Distrelec; ComponentLink11URL: https://datasheet.ciiva.com/7937/4360-7937674.pdf?src-supplier=Element14; ComponentLink11Description: https://datasheet.ciiva.com/7937/4360-7937674.pdf?src-supplier=Element14; ComponentLink12URL: https://datasheet.ciiva.com/5427/product-5427340.pdf?src-supplier=Mouser; ComponentLink12Description: https://datasheet.ciiva.com/5427/product-5427340.pdf?src-supplier=Mouser; ComponentLink13URL: https://datasheet.ciiva.com/16393/product-16393388.pdf?src-supplier=Future+Electronics; ComponentLink13Description: https://datasheet.ciiva.com/16393/product-16393388.pdf?src-supplier=Future+Electronics; JLCPCB Part #: C1622
CONN_BOTT = CLP-106-02-F-D-BE: Connector; Manufacturer_Name: SAMTEC; Datasheet Link: http://suddendocs.samtec.com/prints/erm8-xxx-xx.x-xxx-dv-xxxx-xx-mkt.pdf; Manufacturer_Part_Number: CLP-106-02-F-D-BE; Mouser Part Number: 200-CLP10602FDBE; Mouser Price/Stock: https://www.mouser.co.uk/ProductDetail/Samtec/CLP-106-02-F-D-BE?qs=0lQeLiL1qybMRsXYGL6Lww%3D%3D; Arrow Part Number: CLP-106-02-F-D-BE; Arrow Price/Stock: https://www.arrow.com/en/products/clp-106-02-f-d-be/samtec
D1 D6 D7 D24 = DIOD-D-A1K2-2: Surface Mount Ultra Fast Rectifier, 800V, 1 A, -65 to 125 degC, 2-Pin SMA Package, RoHS, Tape and Reel; Manufacturer: STMicroelectronics; Manufacturer Part Number: STTH108A; Element Configuration: Single; Peak Reverse Current: 5uA; Peak Non-Repetitive Surge Current: 20A; Average Rectified Current: 1A; Forward Voltage: 1.25V; Reverse Recovery Time: 75ns; Polarity: Standard; ComponentLink1URL: http://www.diodes.com/; ComponentLink3URL: http://diodes.com/datasheets/ds16003.pdf; ComponentLink3Description: Package Specification; ComponentLink1Description: Manufacturer URL; ComponentLink2URL: http://diodes.com/datasheets/ds16003.pdf; ComponentLink2Description: Datasheet; Supplier 1: Digi-Key; Supplier Part Number 1: 497-2459-1-ND; Stock 1: 11467; Pricing 1: 1=0,62000, 10=0,53100, 100=0,39660, 500=0,31158, 1000=0,24077, 2500=0,21953 (USD); RoHS: Yes; Mount: Surface Mount; Case/Package: SMA; Number of Pins: 2; Contact Plating: Tin,Matte; Min Operating Temperature: -50°C; Max Operating Temperature: 175°C; Packaging: Tape and Reel; Package Quantity: 5000; Max Reverse Voltage (DC): 800V; Max Repetitive Reverse Voltage (Vrrm): 800V; Forward Current: 1A; Max Surge Current: 20A; Max Forward Surge Current (Ifsm): 20A; Voltage Rating (DC): 800V; Current Rating: 1A; Recovery Time: 75ns; Reverse Voltage: 800V; Output Current: 1A; Termination: SMD/SMT; Length: 4.6mm; Height: 2.03mm; Width: 2.95mm; Radiation Hardening: No; Lead Free: Lead Free; REACH SVHC: No SVHC; ComponentLink4URL: https://datasheet.ciiva.com/5794/483298-5794228.pdf?src-supplier=Farnell; ComponentLink4Description: https://datasheet.ciiva.com/5794/483298-5794228.pdf?src-supplier=Farnell; ComponentLink5URL: https://datasheet.ciiva.com/4453/cd00003259-49416-4453144.pdf?src-supplier=Mouser; ComponentLink5Description: https://datasheet.ciiva.com/4453/cd00003259-49416-4453144.pdf?src-supplier=Mouser; ComponentLink6URL: https://datasheet.ciiva.com/915/cd00003259-915996.pdf?src-supplier=Digi-Key; ComponentLink6Description: https://datasheet.ciiva.com/915/cd00003259-915996.pdf?src-supplier=Digi-Key; ComponentLink7URL: https://datasheet.ciiva.com/915/cd00003259-915997.pdf?src-supplier=Digi-Key; ComponentLink7Description: https://datasheet.ciiva.com/915/cd00003259-915997.pdf?src-supplier=Digi-Key; ComponentLink8URL: https://datasheet.ciiva.com/915/cd00003259-915998.pdf?src-supplier=Digi-Key; ComponentLink8Description: https://datasheet.ciiva.com/915/cd00003259-915998.pdf?src-supplier=Digi-Key; ComponentLink9URL: https://datasheet.ciiva.com/16391/cd00003259-16391743.pdf?src-supplier=Future+Electronics; ComponentLink9Description: https://datasheet.ciiva.com/16391/cd00003259-16391743.pdf?src-supplier=Future+Electronics
D5 D43 = CMP-1055-00560-1: Dual Series Schottky Barrier Diodes, 3-Pin SOT-323, Tape and Reel; Manufacturer: On Semiconductor; IFSM Max (A): 0.6; trr Max (ns): 5; ComponentLink3Description: Package Specification; RoHS: FALSE; ComponentLink1URL: http://www.onsemi.com/; PartNumber: BAT54SWT1; ComponentLink1Description: Manufacturer URL; Packing: Tape and Reel; PackageReference: SOT-323-3-419-04; ComponentLink2URL: http://www.onsemi.cn/pub_link/Collateral/BAT54SWT1-D.PDF; ComponentLink2Description: Datasheet; PackageDescription: 3-Pin Small Outline Transistor, Body 2 x 1.25 mm, Pitch 0.65 mm; Configuration: Dual; ComponentLink3URL: http://www.onsemi.com/pub_link/Collateral/419-04.PDF; Mounting Technology: Surface Mount; PackageVersion: Rev. N, 11/2008; DatasheetVersion: Rev. 10
D11 D12 D41 = CMP-1063-00098-1: Transient Voltage Suppressor, Micro-Packaged Diode for ESD Protection, 2-Pin SOD-523, Pb-Free, Tape and Reel; Manufacturer: On Semiconductor; PartNumber: ESD5Z3.3T1G; VRWM Max (V): 3.3; Number of Lines: 1; V(BR) Min (V): 5; PPK Max (W): 158; Direction: Unidirectional; IR Max (uA): 0.05; PackageReference: SOD-523-2-502-01; PackageVersion: Rev. E, 09/2010; RoHS: Pb-Free; ComponentLink3Description: Package Specification; Packing: Tape and Reel; ComponentLink1URL: http://www.onsemi.com/; DatasheetVersion: Rev. 10; ComponentLink2Description: Datasheet; Mounting Technology: Surface Mount; ComponentLink2URL: http://www.onsemi.cn/pub_link/Collateral/ESD5Z2.5T1-D.PDF; PackageDescription: 2-Pin SOD, Body 1.2 x 0.8 mm; ComponentLink3URL: http://www.onsemi.com/pub_link/Collateral/502-01.PDF; ComponentLink1Description: Manufacturer URL
D25 D27 = CMP-12790-000030-1: DIODE SCHOTTKY 20V 2A POWERDI123; Manufacturer: Diodes Inc.; Manufacturer Part Number: DFLS220L-7; Capacitance: 75pF; Max Junction Temp: +125°C; Max Surge Forward Current: 40A; Peak Reverse Current: 1mA; Value: 75pF; Package: PowerDI123; Temperature: -55°C to +125°C; ComponentLink2Description: Datasheet; RoHS: TRUE; Category: Diode; Digikey Description: DIODE SCHOTTKY 20V 2A POWERDI123; Temperature Range Low: -55°C; Mouser Description: DFLS220L Series 20 V 2 A Surface Mount Schottky Barrier Rectifier - PowerDI-123; Device Class L3: Schottky Diodes; Device Class L2: Diodes; Device Class L1: Discrete Semiconductors; Reverse Voltage: 20V; Max Repetitive Reverse Voltage: 20V; Octopart: https://octopart.com/dfls220l-7-diodes+inc.-328575; Temperature Range High: +125°C; Automotive: No; Forward Current: 2A; Footprint Url: https://www.diodes.com/assets/Package-Files/PowerDI123.pdf; Lead Free: Yes; ComponentLink2URL: https://www.diodes.com/assets/Datasheets/ds30517.pdf; Height: 1mm
D26 D28 = DIODE_ZENER_3V3_SOD323: Diode Zener SMD 3.3V 200mW SOD-323; Manufacturer 1: ON Semiconductor; Manufacturer Part Number 1: MM3Z3V3ST1G; Ratings: 3.3V; 0.2W; Vf=900mV @ 10mA; Material: Si; Tolerance: ±3%; SCDType: source; Package / Case: SOD-323; Diode Type: Zener; Supplier 1: Digi-Key; Supplier Part Number 1: MM3Z3V3ST1GOSCT-ND
D33 D34 = CMP-1055-00481-1: Schottky Barrier Diode, 2-Pin SOD-523, Pb-Free, Tape and Reel; Manufacturer: On Semiconductor; Configuration: Single; Mounting Technology: Surface Mount; ComponentLink1URL: http://www.onsemi.com/; ComponentLink3Description: Package Specification; Packing: Tape and Reel; ComponentLink2Description: Datasheet; PackageVersion: Rev. E, 09/2010; PackageReference: SOD-523-2-502-01; ComponentLink2URL: http://www.onsemi.cn/pub_link/Collateral/RB520S30T1-D.PDF; ComponentLink1Description: Manufacturer URL; DatasheetVersion: Rev. 10; RoHS: TRUE; ComponentLink3URL: http://www.onsemi.com/pub_link/Collateral/502-01.PDF; PackageDescription: 2-Pin SOD, Body 1.2 x 0.8 mm; PartNumber: RB520S30T5G
D35 = CMP-2000-06158-1: Low VF Schottky Barrier Rectifier, 2 A, 40 V, -55 to 125 degC, 2-Pin SMD, RoHS, Tape and Reel; Manufacturer: Diodes Inc; Reverse Voltage-Max [Vrrm]: 40V; Forward Voltage: 0.5V; Average Rectified Current-Max: 2A; Peak Current-Max: 50A; Reverse Current-Max: 100µA; Mounting Technology: SurfaceMount; Package Description: 2-Pin Small Outline Diode, Body 2.8 x 1.78 mm; Manufacturer URL: http://www.diodes.com/; Datasheet URL: http://www.diodes.com/_files/datasheets/ds30516.pdf; Package Reference: POWERDI123-2_A; Datasheet Version: Rev. 8-2, 11/2009
D42 = CMP-0881-00001-1: High Conductance Fast Switching Diode, 75 V, -55 to 150 degC, 2-Pin SOD523F, RoHS; Manufacturer: Fairchild Semiconductor; IR (VR: 75 V)=5 uA Max.; VF: 1 V Max.; BVR (IR: 5 uA)=75 V Min.; CO: 4 pF Max.; DatasheetVersion: Rev. A2; ComponentLink1Description: Manufacturer URL; PackageDescription: 2-Pin Surface Mount Device, Body 1.2 x 0.8 mm, Height 0.7 mm; ComponentLink2URL: http://www.fairchildsemi.com/ds/1N/1N4148WT.pdf; ComponentLink2Description: Datasheet; PartNumber: 1N4148WT; ComponentLink1URL: http://www.fairchildsemi.com/; Temperature Range: -55 to 150 degC; Mounting Technology: Surface Mount; PackageReference: SOD-523F-2; RoHS: TRUE
D45 D46 = CMP-1060-00709-1: Zener Voltage Regulator, 300 mW, 2-Pin SOD-323, Pb-Free, Tape and Reel; Manufacturer: On Semiconductor; PartNumber: MM3Z16VT1G; VZ Typ (V): 16.2; P Max (W): 0.3; ComponentLink3URL: http://www.onsemi.com/pub_link/Collateral/477-02.PDF.1; ComponentLink1Description: Manufacturer URL; PackageReference: SOD-323-2-477-02; PackageVersion: Rev. H, 03/2007; Packing: Tape and Reel; PackageDescription: 2-Pin SOD, Body 1.7 x 1.25 mm; ComponentLink2URL: http://www.onsemi.cn/pub_link/Collateral/MM3Z2V4T1-D.PDF; ComponentLink3Description: Package Specification; DatasheetVersion: Rev. 9; ComponentLink1URL: http://www.onsemi.com/; RoHS: Pb-Free; Mounting Technology: Surface Mount; ComponentLink2Description: Datasheet
FB2-FB5 FB7 FB10 FB11 FB14 FB16-FB18 = CMP-0220-00115-1: SMD EMI Suppression Ferrite Bead WE-CBF, Z = 1500 Ohm; DatasheetVersion: Dec-2005; ComponentLink1URL: http://www.we-online.com; PackageVersion: 2009; PackageDescription: Chip Inductor, 2-Leads, Body 1.6 x 0.8 mm; ComponentLink2URL: http://www.we-online.de/katalog/media/pdf/742792691.pdf; ComponentLink1Description: Manufacturer Link; ComponentLink2Description: Datasheet; Impedance: 1500 Ohm; PackageReference: SMD-0603
FB8 = PAS-IND-INDUCTOR-2: SMD EMI Suppression Ferrite Bead WE-CBF, Z = 1500 Ohm; DatasheetVersion: Dec-2005; ComponentLink1URL: http://www.we-online.com; PackageVersion: 2009; PackageDescription: Chip Inductor, 2-Leads, Body 1.6 x 0.8 mm; ComponentLink2URL: http://www.we-online.de/katalog/media/pdf/742792691.pdf; ComponentLink1Description: Manufacturer Link; ComponentLink2Description: Datasheet; Impedance: 1500 Ohm; PackageReference: SMD-0603
IC1 = STM32G431KBU3: Microcontroller 32-Bit ARM Cortex-M4 RISC 128KB Flash 1.71V to 3.6V 32-Pin UFQFPN; Manufacturer_Name: STMicroelectronics; Manufacturer Part Number: STM32G431KBU6; Datasheet Link: https://componentsearchengine.com/Datasheets/1/STM32G431KBU3.pdf; Height: 0.6mm; Manufacturer_Part_Number: STM32G431KBU3; Mouser Part Number: 511-STM32G431KBU3; Mouser Price/Stock: https://www.mouser.co.uk/ProductDetail/STMicroelectronics/STM32G431KBU3?qs=PzGy0jfpSMtowkKWTRQBRw%3D%3D; Arrow Part Number: STM32G431KBU3; Arrow Price/Stock: https://www.arrow.com/en/products/stm32g431kbu3/stmicroelectronics; Supplier 1: Digi-Key; Manufacturer: STMicroelectronics; RoHS: No; Category: Microcontrollers; Stock 1: 293; Pricing 1: 1=5.78000, 10=5.18800, 25=4.90440, 80=4.25038, 230=4.03239, 490=3.61827, 980=3.17870 (USD)
J3 = Header 6: Header, 6-Pin; LatestRevisionDate: 17-Jul-2002; LatestRevisionNote: Re-released for DXP Platform.; Publisher: Altium Limited
L6 = CMP-08253-000028-1: INDUCTORS FOR POWER CIRCUITS, AU